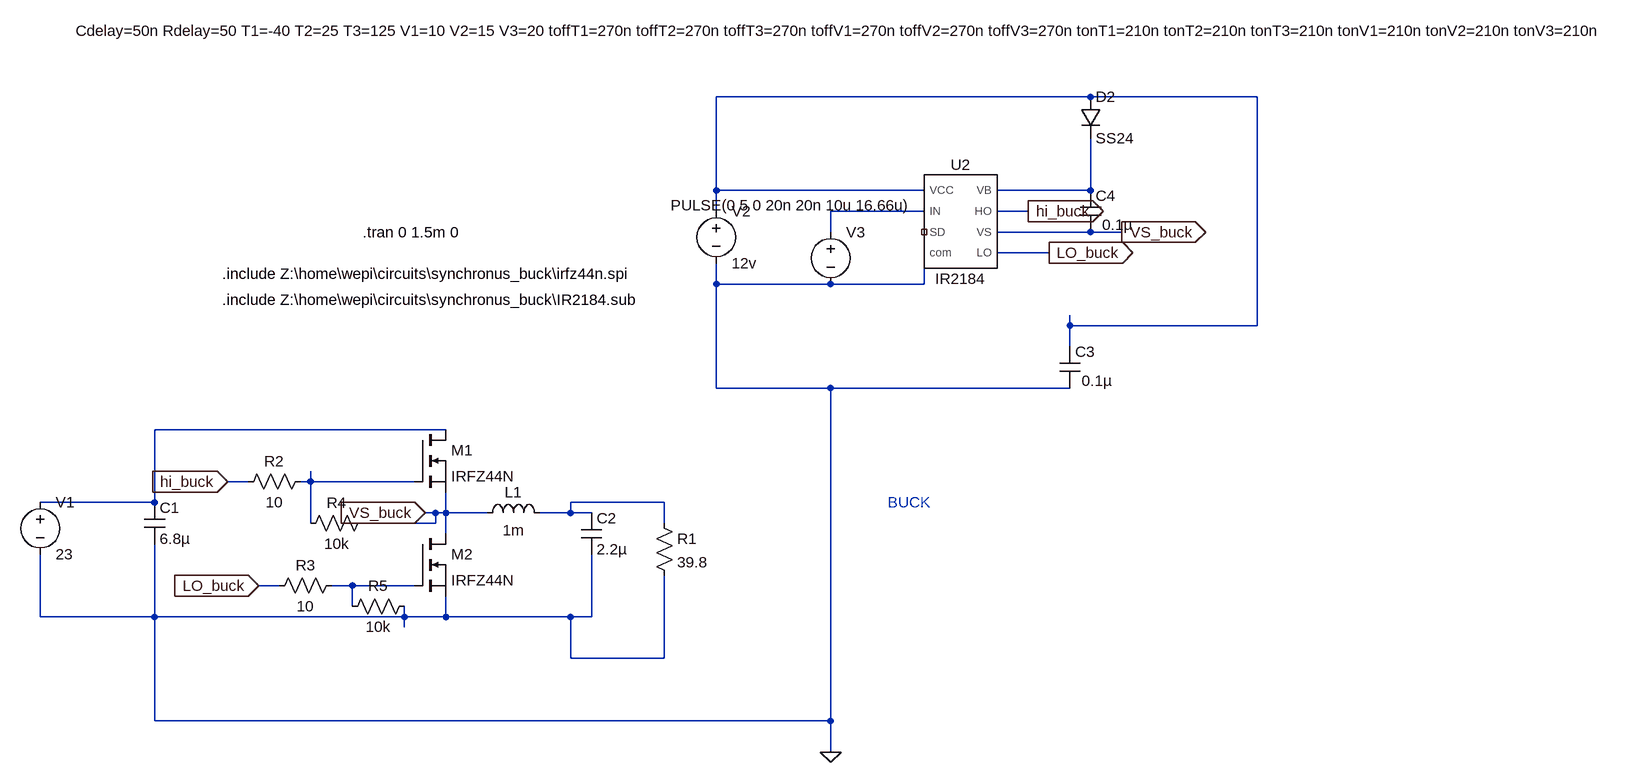
[diagram p0: schematic synchronus_buck.asc]
synchronus_buck.asc, the LTspice schematic file:
Version 4.1
SHEET 1 4172 1140
WIRE 1600 -560 1024 -560
WIRE 1856 -560 1600 -560
WIRE 1024 -416 1024 -560
WIRE 1344 -416 1024 -416
WIRE 1600 -416 1600 -496
WIRE 1600 -416 1456 -416
WIRE 1024 -384 1024 -416
WIRE 1344 -384 1200 -384
WIRE 1504 -384 1456 -384
WIRE 1200 -352 1200 -384
WIRE 1600 -352 1456 -352
WIRE 1648 -352 1600 -352
WIRE 1536 -320 1456 -320
WIRE 1024 -272 1024 -304
WIRE 1200 -272 1024 -272
WIRE 1344 -272 1344 -320
WIRE 1344 -272 1200 -272
WIRE 1568 -208 1568 -224
WIRE 1856 -208 1856 -560
WIRE 1856 -208 1568 -208
WIRE 1568 -176 1568 -208
WIRE 1024 -112 1024 -272
WIRE 1200 -112 1024 -112
WIRE 1568 -112 1200 -112
WIRE 608 -48 160 -48
WIRE 304 32 272 32
WIRE 400 32 400 16
WIRE 400 32 384 32
WIRE 560 32 400 32
WIRE 160 64 160 -48
WIRE 160 64 -16 64
WIRE 944 64 800 64
WIRE 592 80 576 80
WIRE 608 80 608 48
WIRE 608 80 592 80
WIRE 672 80 608 80
WIRE 800 80 800 64
WIRE 800 80 752 80
WIRE 832 80 800 80
WIRE 400 96 400 32
WIRE 592 96 592 80
WIRE 592 96 480 96
WIRE 944 96 944 64
WIRE 608 112 608 80
WIRE 352 192 320 192
WIRE 464 192 432 192
WIRE 560 192 464 192
WIRE 464 224 464 192
WIRE -16 240 -16 144
WIRE 160 240 160 128
WIRE 160 240 -16 240
WIRE 544 240 544 224
WIRE 544 240 160 240
WIRE 608 240 608 208
WIRE 608 240 544 240
WIRE 800 240 608 240
WIRE 832 240 832 144
WIRE 832 240 800 240
WIRE 544 256 544 240
WIRE 800 304 800 240
WIRE 944 304 944 176
WIRE 944 304 800 304
WIRE 160 400 160 240
WIRE 1200 400 1200 -112
WIRE 1200 400 160 400
WIRE 1200 448 1200 400
FLAG 1200 448 0
FLAG 272 32 hi_buck
IOPIN 272 32 In
FLAG 1504 -384 hi_buck
IOPIN 1504 -384 Out
FLAG 320 192 LO_buck
IOPIN 320 192 In
FLAG 1536 -320 LO_buck
IOPIN 1536 -320 Out
FLAG 1648 -352 VS_buck
IOPIN 1648 -352 Out
FLAG 576 80 VS_buck
IOPIN 576 80 In
SYMBOL voltage -16 48 R0
WINDOW 123 0 0 Left 0
WINDOW 39 0 0 Left 0
SYMATTR InstName V1
SYMATTR Value 23
SYMBOL cap 144 64 R0
SYMATTR InstName C1
SYMATTR Value 6.8µ
SYMATTR SpiceLine V=4 Irms=9.59 Rser=0.00574865 Lser=0 mfg="KEMET" pn="C0603C685K7PAC" type="X5R"
SYMBOL ind 656 96 R270
WINDOW 0 32 56 VTop 2
WINDOW 3 5 56 VBottom 2
SYMATTR InstName L1
SYMATTR Value 1m
SYMATTR SpiceLine Rser=0.3
SYMBOL nmos 560 112 R0
SYMATTR InstName M2
SYMATTR Value IRFZ44N
SYMBOL nmos 560 -48 R0
SYMATTR InstName M1
SYMATTR Value IRFZ44N
SYMBOL cap 816 80 R0
SYMATTR InstName C2
SYMATTR Value 2.2µ
SYMATTR SpiceLine V=4 Irms=7.1 Rser=0.00682 Lser=0 mfg="KEMET" pn="C0805C225K7PAC" type="X5R"
SYMBOL res 928 80 R0
SYMATTR InstName R1
SYMATTR Value 39.8
SYMBOL voltage 1024 -400 R0
WINDOW 123 0 0 Left 0
WINDOW 39 0 0 Left 0
SYMATTR InstName V2
SYMATTR Value 12v
SYMBOL diode 1584 -560 R0
SYMATTR InstName D2
SYMATTR Value SS24
SYMATTR Description Diode
SYMATTR Type diode
SYMBOL cap 1552 -176 R0
WINDOW 3 34 53 Left 2
SYMATTR InstName C3
SYMATTR Value 0.1µ
SYMATTR SpiceLine V=4 Irms=0 Rser=0 Lser=0 mfg="Murata" pn="GRM022R60G153KE15" type="X5R"
SYMBOL cap 1584 -416 R0
WINDOW 3 34 53 Left 2
SYMATTR InstName C4
SYMATTR Value 0.1µ
SYMATTR SpiceLine V=4 Irms=0 Rser=0 Lser=0 mfg="Murata" pn="GRM022R60G153KE15" type="X5R"
SYMBOL voltage 1200 -368 R0
WINDOW 3 -246 -25 Left 2
WINDOW 123 0 0 Left 0
WINDOW 39 0 0 Left 0
SYMATTR InstName V3
SYMATTR Value PULSE(0 5 0 20n 20n 10u 16.66u)
SYMBOL synchronus_buck\\IR2184 1392 -368 R0
WINDOW 39 -160 -309 Top 2
SYMATTR InstName U2
SYMBOL res 400 16 R90
WINDOW 0 0 56 VBottom 2
WINDOW 3 32 56 VTop 2
SYMATTR InstName R2
SYMATTR Value 10
SYMBOL res 448 176 R90
WINDOW 0 0 56 VBottom 2
WINDOW 3 32 56 VTop 2
SYMATTR InstName R3
SYMATTR Value 10
SYMBOL res 496 80 R90
WINDOW 0 0 56 VBottom 2
WINDOW 3 32 56 VTop 2
SYMATTR InstName R4
SYMATTR Value 10k
SYMBOL res 560 208 R90
WINDOW 0 0 56 VBottom 2
WINDOW 3 32 56 VTop 2
SYMATTR InstName R5
SYMATTR Value 10k
TEXT 264 -288 Left 2 !.include Z:\\home\\wepi\\circuits\\synchronus_buck\\irfz44n.spi
TEXT 264 -248 Left 2 !.include Z:\\home\\wepi\\circuits\\synchronus_buck\\IR2184.sub
TEXT 480 -352 Left 2 !.tran 0 1.5m 0
TEXT 1288 64 Left 2 ;BUCK

The netlist it stands for:
* synchronus_buck.asc
V1 N004 0 23
C1 N004 0 6.8µ V=4 Irms=9.59 Rser=0.00574865 Lser=0 mfg="KEMET" pn="C0603C685K7PAC" type="X5R"
L1 VS_buck N006 1m Rser=0.3
M2 VS_buck N007 0 0 IRFZ44N
M1 N004 N005 VS_buck VS_buck IRFZ44N
C2 N006 0 2.2µ V=4 Irms=7.1 Rser=0.00682 Lser=0 mfg="KEMET" pn="C0805C225K7PAC" type="X5R"
R1 N006 0 39.8
V2 N001 0 12v
D2 N001 N002 SS24
C3 N001 0 0.1µ V=4 Irms=0 Rser=0 Lser=0 mfg="Murata" pn="GRM022R60G153KE15" type="X5R"
C4 N002 VS_buck 0.1µ V=4 Irms=0 Rser=0 Lser=0 mfg="Murata" pn="GRM022R60G153KE15" type="X5R"
V3 N003 0 PULSE(0 5 0 20n 20n 10u 16.66u)
X§U2 N001 N003 NC_01 0 N002 hi_buck VS_buck LO_buck IR2184 Cdelay=50n Rdelay=50 T1=-40 T2=25 T3=125 V1=10 V2=15 V3=20 toffT1=270n toffT2=270n toffT3=270n toffV1=270n toffV2=270n toffV3=270n tonT1=210n tonT2=210n tonT3=210n tonV1=210n tonV2=210n tonV3=210n  ; pins VCC IN SD com VB HO VS LO
R2 N005 hi_buck 10
R3 N007 LO_buck 10
R4 VS_buck N005 10k
R5 0 N007 10k
.model D D
.lib standard.dio
.model NMOS NMOS
.model PMOS PMOS
.lib standard.mos
.include Z:\home\wepi\circuits\synchronus_buck\irfz44n.spi
.include Z:\home\wepi\circuits\synchronus_buck\IR2184.sub
.tran 0 1.5m 0
* BUCK
.lib Z:\home\wepi\circuits\synchronus_buck\IR2184.sub
.backanno
.end